# Altium schematic sheet AudioCodec.SchDoc
size A3; SheetNumber: 9; SheetTotal: 8
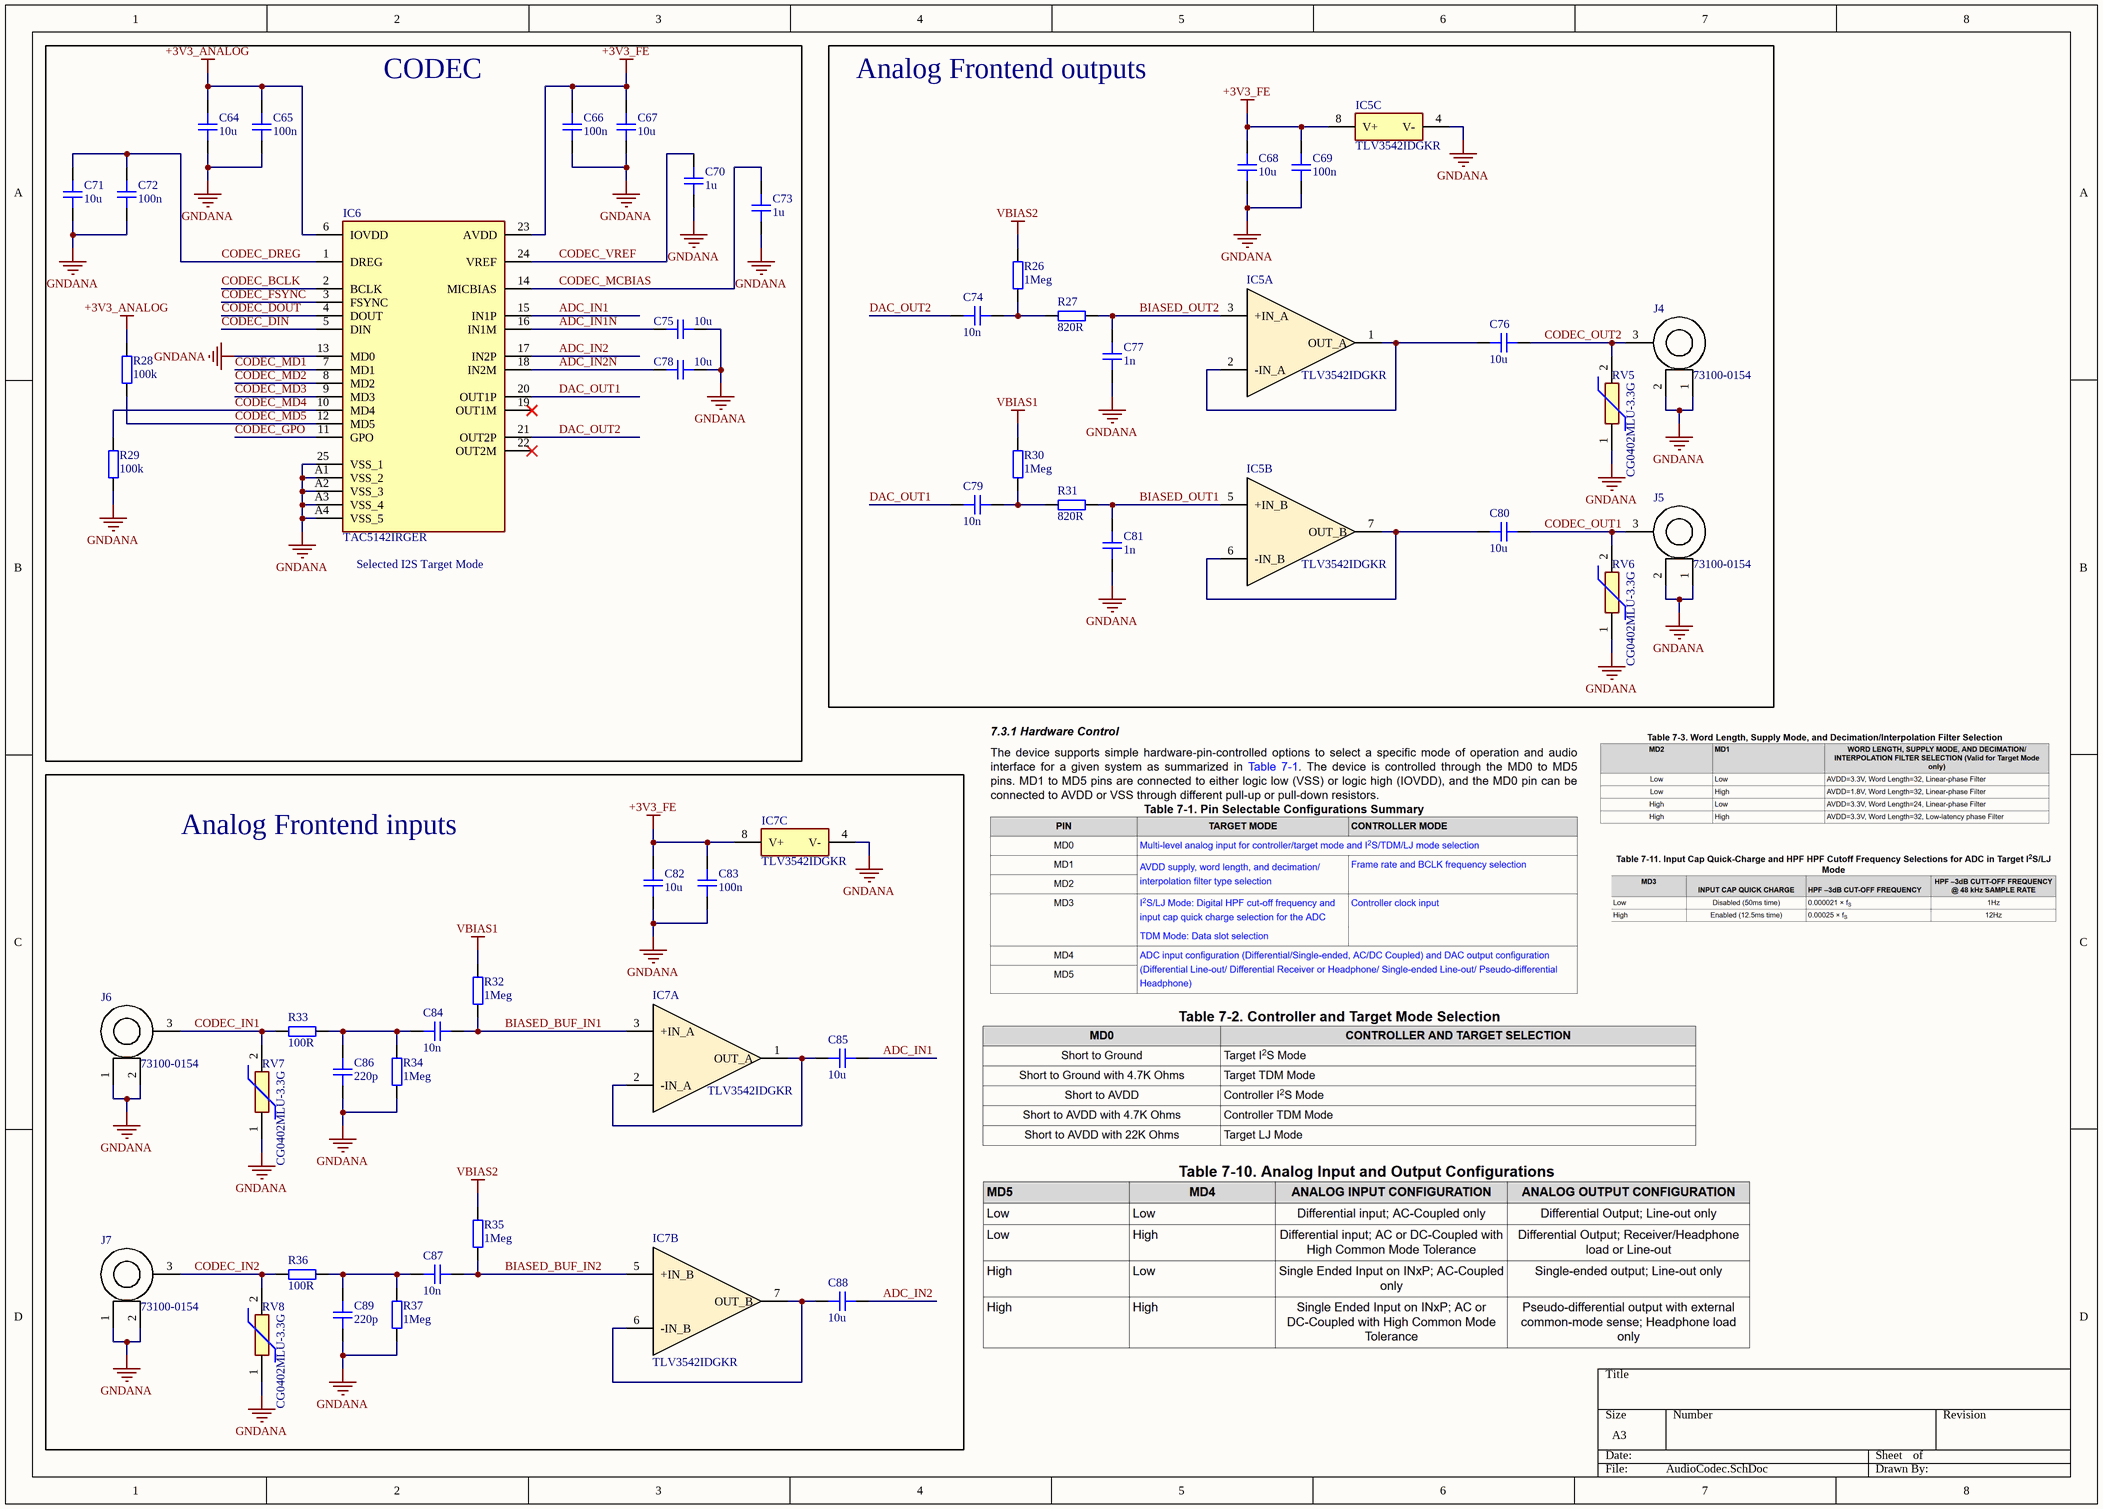
[diagram p0: AudioCodec.SchDoc]

## Parts
C64  10u  [CAP_0603]
C65  100n  [CAP_0402]
C66  100n  [CAP_0402]
C67  10u  [CAP_0603]
C68  10u  [CAP_0603]
C69  100n  [CAP_0402]
C70  1u  [CAP_0402]
C71  10u  [CAP_0603]
C72  100n  [CAP_0402]
C73  1u  [CAP_0402]
C74  10n  [CAP_0402]
C75  10u  [CAP_0603]
C76  10u  [CAP_0603]
C77  1n  [CAP_0402]
C78  10u  [CAP_0603]
C79  10n  [CAP_0402]
C80  10u  [CAP_0603]
C81  1n  [CAP_0402]
C82  10u  [CAP_0603]
C83  100n  [CAP_0402]
C84  10n  [CAP_0402]
C85  10u  [CAP_0603]
C86  220p  [CAP_0402]
C87  10n  [CAP_0402]
C88  10u  [CAP_0603]
C89  220p  [CAP_0402]
IC5  TLV3542IDGKR  [SOP65P490X110-8N]  (parts A,B,C of 3)
IC6  TAC5142IRGER  [TAC5142IRGER]
IC7  TLV3542IDGKR  [SOP65P490X110-8N]  (parts A,B,C of 3)
J4  73100-0154  [73100-0105]
J5  73100-0154  [73100-0105]
J6  73100-0154  [73100-0105]
J7  73100-0154  [73100-0105]
R26  1Meg  [RES_0402]
R27  820R  [RES_0402]
R28  100k  [RES_0402]
R29  100k  [RES_0402]
R30  1Meg  [RES_0402]
R31  820R  [RES_0402]
R32  1Meg  [RES_0402]
R33  100R  [RES_0402]
R34  1Meg  [RES_0402]
R35  1Meg  [RES_0402]
R36  100R  [RES_0402]
R37  1Meg  [RES_0402]
RV5  CG0402MLU-3.3G  [VARC1005X41N]
RV6  CG0402MLU-3.3G  [VARC1005X41N]
RV7  CG0402MLU-3.3G  [VARC1005X41N]
RV8  CG0402MLU-3.3G  [VARC1005X41N]

## Blocks framed on the sheet
CODEC: C64-C67 C70-C73 C75 C78 IC6 R28 R29
Analog Frontend outputs: C68 C69 C74 C76 C77 C79-C81 IC5 J4 J5 R26 R27 R30 R31 RV5 RV6
Analog Frontend inputs: C82-C89 IC7 J6 J7 R32-R37 RV7 RV8

## Nets
+3V3_ANALOG: C64.2 C65.2 IC6.6(IOVDD) R28.2
+3V3_FE: C66.2 C67.2 C68.2 C69.2 C82.2 C83.2 IC5.8(V+) IC6.23(AVDD) IC7.8(V+)
GNDANA: C64.1 C65.1 C66.1 C67.1 C68.1 C69.1 C70.1 C71.1 C72.1 C73.1 C75.1 C77.2 C78.1 C81.2 C82.1 C83.1 C86.1 C89.1 IC5.4(V-) IC6.13(MD0) IC6.25(VSS_1) IC6.A1(VSS_2) IC6.A2(VSS_3) IC6.A3(VSS_4) IC6.A4(VSS_5) IC7.4(V-) J4.1 J4.2 J5.1 J5.2 J6.1 J6.2 J7.1 J7.2 R29.1 R34.1 R37.1 RV5.1 RV6.1 RV7.1 RV8.1
VBIAS1: R30.2 R32.2
VBIAS2: R26.2 R35.2
ADC_IN1: C85.1 IC6.15(IN1P)
ADC_IN1N: C75.2 IC6.16(IN1M)
ADC_IN2: C88.1 IC6.17(IN2P)
ADC_IN2N: C78.2 IC6.18(IN2M)
BIASED_BUF_IN1: C84.1 IC7.3(+IN_A) R32.1
BIASED_BUF_IN2: C87.1 IC7.5(+IN_B) R35.1
BIASED_OUT1: C81.1 IC5.5(+IN_B) R31.1
BIASED_OUT2: C77.1 IC5.3(+IN_A) R27.1
CODEC_BCLK: IC6.2(BCLK)
CODEC_DIN: IC6.5(DIN)
CODEC_DOUT: IC6.4(DOUT)
CODEC_DREG: C71.2 C72.2 IC6.1(DREG)
CODEC_FSYNC: IC6.3(FSYNC)
CODEC_GPO: IC6.11(GPO)
CODEC_IN1: J6.3 R33.2 RV7.2
CODEC_IN2: J7.3 R36.2 RV8.2
CODEC_MCBIAS: C73.2 IC6.14(MICBIAS)
CODEC_MD1: IC6.7(MD1)
CODEC_MD2: IC6.8(MD2)
CODEC_MD3: IC6.9(MD3)
CODEC_MD4: IC6.10(MD4) R29.2
CODEC_MD5: IC6.12(MD5) R28.1
CODEC_OUT1: C80.1 J5.3 RV6.2
CODEC_OUT2: C76.1 J4.3 RV5.2
CODEC_VREF: C70.2 IC6.24(VREF)
DAC_OUT1: C79.2 IC6.20(OUT1P)
DAC_OUT2: C74.2 IC6.21(OUT2P)
NetC74_1: C74.1 R26.1 R27.2
NetC76_2: C76.2 IC5.1(OUT_A) IC5.2(-IN_A)
NetC79_1: C79.1 R30.1 R31.2
NetC80_2: C80.2 IC5.6(-IN_B) IC5.7(OUT_B)
NetC84_2: C84.2 C86.2 R33.1 R34.2
NetC85_2: C85.2 IC7.1(OUT_A) IC7.2(-IN_A)
NetC87_2: C87.2 C89.2 R36.1 R37.2
NetC88_2: C88.2 IC7.6(-IN_B) IC7.7(OUT_B)

Not connected (* = marked no-connect by the designer): IC6 19(OUT1M)* 22(OUT2M)*

## Notes on the sheet
- (near IC6) Selected I2S Target Mode

## Library data of the parts
C64 C67 C68 C71 C75 C76 C78 C80 C82 C85 C88 = CAP_0603: Capacitor SMD 0603; Manufacturer: *; Manufacturer Part Number: *; Distributor Link: *; LCSC: *; Rating: *; Dielectric: *
C65 C66 C69 C70 C72-C74 C77 C79 C81 C83 C84 C86 C87 C89 = CAP_0402: Capacitor SMD 0402; Manufacturer: *; Manufacturer Part Number: *; Distributor Link: *; LCSC: *; Rating: *; Dielectric: *
IC5 IC7 = TLV3542IDGKR: Integrated Circuit; Manufacturer_Name: Texas Instruments; Datasheet Link: http://www.ti.com/lit/gpn/tlv3542; Height: 1.1mm; Manufacturer_Part_Number: TLV3542IDGKR; Mouser Part Number: 595-TLV3542IDGKR; Mouser Price/Stock: https://www.mouser.co.uk/ProductDetail/Texas-Instruments/TLV3542IDGKR?qs=9lcNTSmDlCr5gl2sVJgJdw%3D%3D; Arrow Part Number: TLV3542IDGKR; Arrow Price/Stock: https://www.arrow.com/en/products/tlv3542idgkr/texas-instruments
IC6 = TAC5142IRGER: Integrated Circuit; Manufacturer_Name: Texas Instruments; Datasheet Link: https://www.ti.com/lit/ds/symlink/tac5142.pdf?ts=1734594132889&ref_url=https%253A%252F%252Fwww.ti.com%252Fproduct%252FTAC5142; Height: 1mm; Manufacturer_Part_Number: TAC5142IRGER
J4-J7 = 73100-0105: Connector; Manufacturer_Name: Molex; Datasheet Link: http://www.farnell.com/datasheets/2125064.pdf; Manufacturer_Part_Number: 73100-0105; Mouser Part Number: 538-73100-0105; Mouser Price/Stock: https://www.mouser.co.uk/ProductDetail/Molex/73100-0105?qs=K8BHR703ZXgAHDUsVPihfA%3D%3D
R26-R37 = RES_0402: Resistor SMD 0402; Manufacturer: *; Manufacturer Part Number: *; Distributor Link: *; LCSC: *
RV5-RV8 = CG0402MLU-3.3G: ESD Diode; Manufacturer_Name: Bourns; Datasheet Link: https://www.bourns.com/docs/Product-Datasheets/MLU.pdf; Height: 0.41mm; Manufacturer_Part_Number: CG0402MLU-3.3G; Mouser Part Number: 652-CG0402MLU-3.3G; Mouser Price/Stock: https://www.mouser.co.uk/ProductDetail/Bourns/CG0402MLU-3.3G?qs=m8myXnDJXpWVM8EQWErxtQ%3D%3D; Arrow Part Number: CG0402MLU-3.3G; Arrow Price/Stock: https://www.arrow.com/en/products/cg0402mlu-3.3g/bourns?utm_currency=USD&region=nac